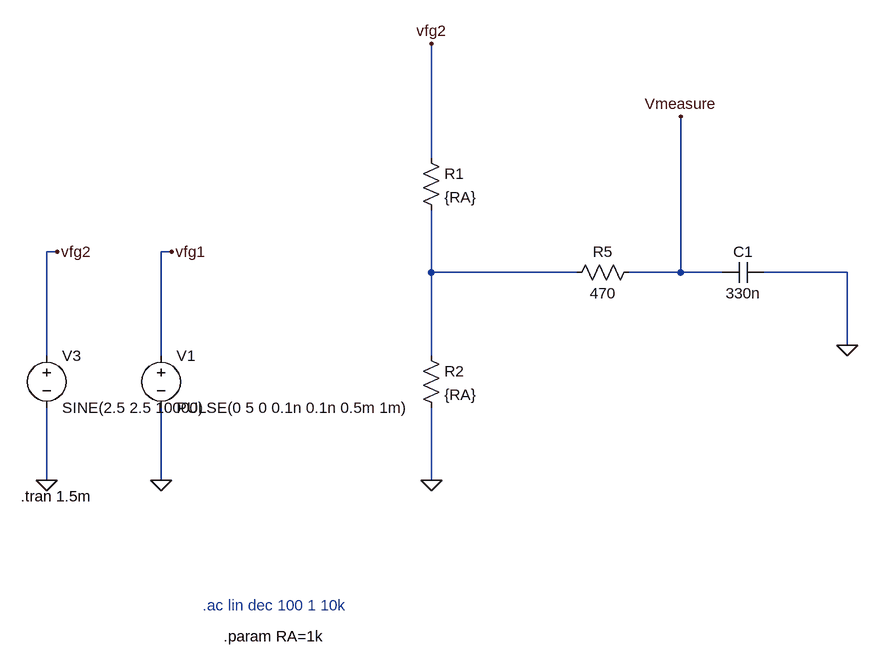
[diagram p0: schematic HW_task1 task1– ADC DAC.asc]
HW_task1 task1– ADC DAC.asc, the LTspice schematic file:
Version 4.1
SHEET 1 1348 712
WIRE 688 -96 688 -272
WIRE 112 48 96 48
WIRE 288 48 272 48
WIRE 688 80 688 -16
WIRE 912 80 688 80
WIRE 1072 80 1072 -160
WIRE 1072 80 992 80
WIRE 1136 80 1072 80
WIRE 1328 80 1200 80
WIRE 1328 192 1328 80
WIRE 96 208 96 48
WIRE 272 208 272 48
WIRE 688 208 688 80
WIRE 96 400 96 288
WIRE 272 400 272 288
WIRE 688 400 688 288
FLAG 96 400 0
FLAG 272 400 0
FLAG 688 400 0
FLAG 1328 192 0
FLAG 112 48 vfg2
FLAG 688 -272 vfg2
FLAG 288 48 vfg1
FLAG 1072 -160 Vmeasure
DATAFLAG 688 384 ""
SYMBOL voltage 96 192 R0
WINDOW 123 0 0 Left 0
WINDOW 39 0 0 Left 0
SYMATTR InstName V3
SYMATTR Value SINE(2.5 2.5 10000)
SYMBOL voltage 272 192 R0
WINDOW 123 0 0 Left 0
WINDOW 39 0 0 Left 0
SYMATTR InstName V1
SYMATTR Value PULSE(0 5 0 0.1n 0.1n 0.5m 1m)
SYMBOL res 672 -112 R0
SYMATTR InstName R1
SYMATTR Value {RA}
SYMBOL res 672 192 R0
SYMATTR InstName R2
SYMATTR Value {RA}
SYMBOL res 1008 64 R90
WINDOW 0 0 56 VBottom 2
WINDOW 3 32 56 VTop 2
SYMATTR InstName R5
SYMATTR Value 470
SYMBOL cap 1200 64 R90
WINDOW 0 0 32 VBottom 2
WINDOW 3 32 32 VTop 2
SYMATTR InstName C1
SYMATTR Value 330n
TEXT 56 424 Left 2 !.tran 1.5m
TEXT 336 592 Left 2 ;.ac lin dec 100 1 10k
TEXT 368 640 Left 2 !.param RA=1k

The netlist it stands for:
* HW_task1 task1– ADC DAC.asc
V3 vfg2 0 SINE(2.5 2.5 10000)
V1 vfg1 0 PULSE(0 5 0 0.1n 0.1n 0.5m 1m)
R1 vfg2 N001 {RA}
R2 N001 0 {RA}
R5 Vmeasure N001 470
C1 0 Vmeasure 330n
.tran 1.5m
* .ac lin dec 100 1 10k
.param RA=1k
.backanno
.end